# Altium project Camera.PrjPcb
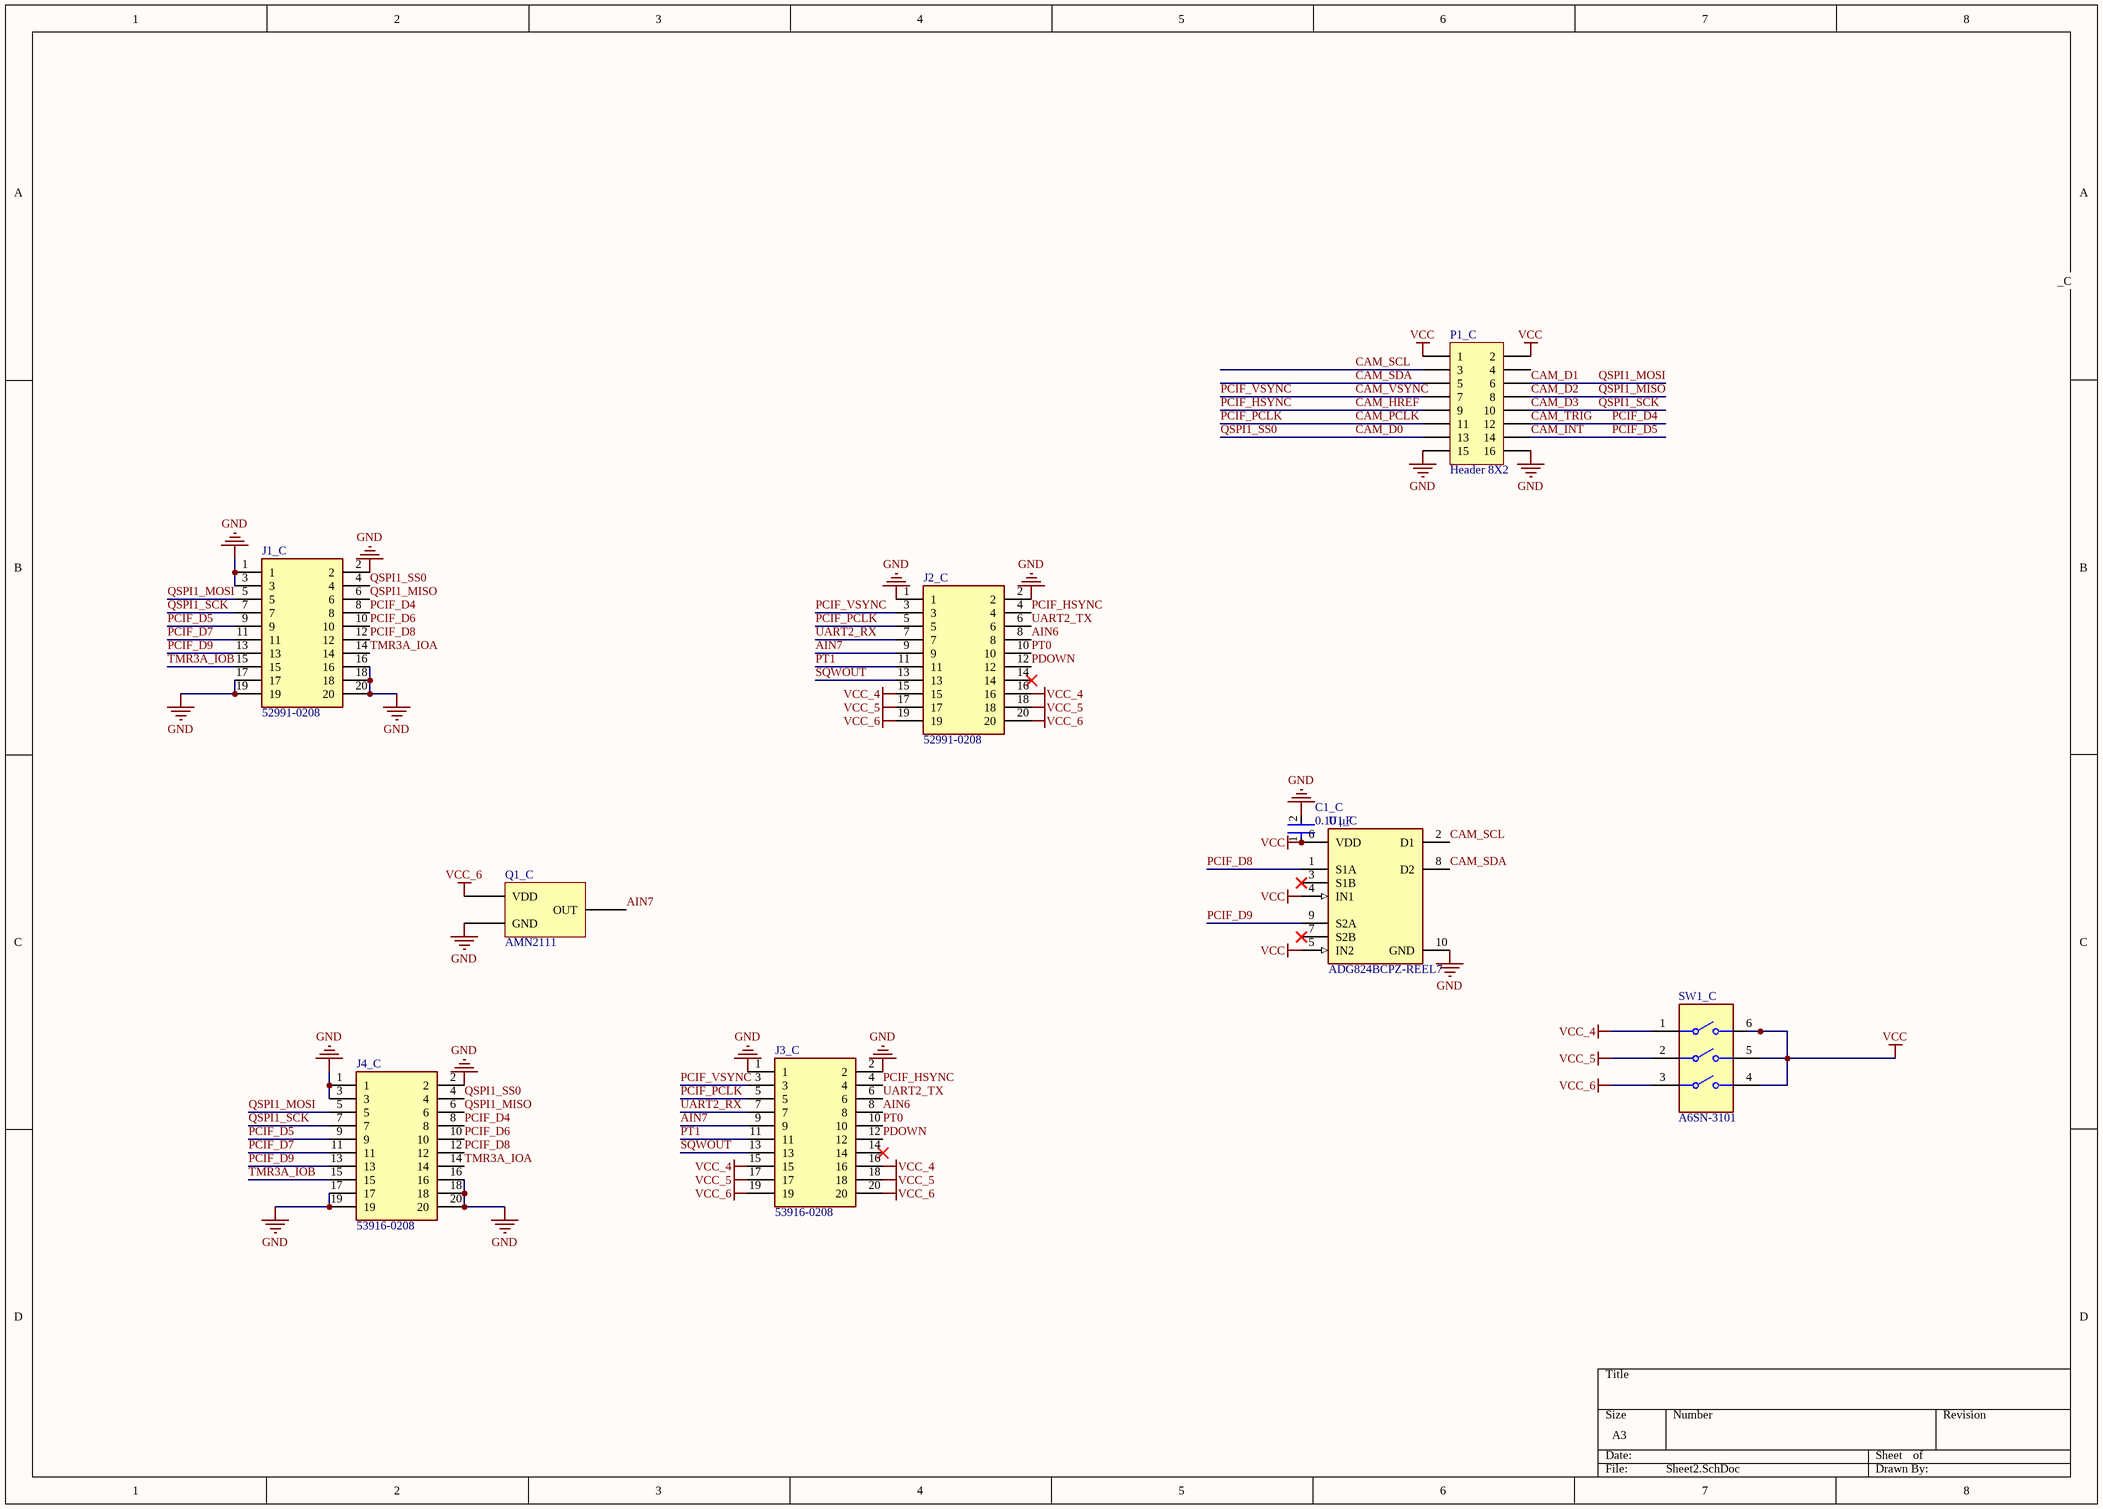
[diagram p0: Sheet2.SchDoc]
1 sheet, 9 parts. Net scope: global (net labels, ports and power ports of the same name join across sheets).
Board file: PCB3.PcbDoc

## Sheet Sheet2.SchDoc
size A3; SheetNumber: 1; SheetTotal: 1

### Parts
C1_C  Capacitance: 0.10 μF  [FP-C0402-BB-MFG]  (hidden comment: C0402C104K8PACTU)
J1_C  52991-0208  [MOLEX_52991-0208]
J2_C  52991-0208  [MOLEX_52991-0208]
J3_C  53916-0208  [MOLEX-  539160208]
J4_C  53916-0208  [MOLEX-  539160208]
P1_C  Header 8X2  [HDR2X8]
Q1_C  AMN2111  [AMN21111]
SW1_C  A6SN-3101  [FP-A6SN-3101-MFG]
U1_C  ADG824BCPZ-REEL7  [FP-CP-10-10-MFG]

### Nets
GND: C1_C.2 J1_C.1 J1_C.2 J1_C.3 J1_C.16 J1_C.17 J1_C.18 J1_C.19 J1_C.20 J2_C.1 J2_C.2 J3_C.1 J3_C.2 J4_C.1 J4_C.2 J4_C.3 J4_C.16 J4_C.17 J4_C.18 J4_C.19 J4_C.20 P1_C.15 P1_C.16 Q1_C.2(GND) U1_C.10(GND)
VCC: C1_C.1 P1_C.1 P1_C.2 SW1_C.4 SW1_C.5 SW1_C.6 U1_C.4(IN1) U1_C.5(IN2) U1_C.6(VDD)
VCC_4: J2_C.15 J2_C.16 J3_C.15 J3_C.16 SW1_C.1
VCC_5: J2_C.17 J2_C.18 J3_C.17 J3_C.18 SW1_C.2
VCC_6: J2_C.19 J2_C.20 J3_C.19 J3_C.20 Q1_C.1(VDD) SW1_C.3
AIN6: J2_C.8 J3_C.8
AIN7: J2_C.9 J3_C.9 Q1_C.3(OUT)
CAM_D0: J1_C.4 J4_C.4 P1_C.13  [also labelled QSPI1_SS0]
CAM_D1: J1_C.5 J4_C.5 P1_C.6  [also labelled QSPI1_MOSI]
CAM_D2: J1_C.6 J4_C.6 P1_C.8  [also labelled QSPI1_MISO]
CAM_D3: J1_C.7 J4_C.7 P1_C.10  [also labelled QSPI1_SCK]
CAM_HREF: J2_C.4 J3_C.4 P1_C.9  [also labelled PCIF_HSYNC]
CAM_INT: J1_C.9 J4_C.9 P1_C.14  [also labelled PCIF_D5]
CAM_PCLK: J2_C.5 J3_C.5 P1_C.11  [also labelled PCIF_PCLK]
CAM_SCL: P1_C.3 U1_C.2(D1)
CAM_SDA: P1_C.5 U1_C.8(D2)
CAM_TRIG: J1_C.8 J4_C.8 P1_C.12  [also labelled PCIF_D4]
CAM_VSYNC: J2_C.3 J3_C.3 P1_C.7  [also labelled PCIF_VSYNC]
PCIF_D6: J1_C.10 J4_C.10
PCIF_D7: J1_C.11 J4_C.11
PCIF_D8: J1_C.12 J4_C.12 U1_C.1(S1A)
PCIF_D9: J1_C.13 J4_C.13 U1_C.9(S2A)
PDOWN: J2_C.12 J3_C.12
PT0: J2_C.10 J3_C.10
PT1: J2_C.11 J3_C.11
SQWOUT: J2_C.13 J3_C.13
TMR3A_IOA: J1_C.14 J4_C.14
TMR3A_IOB: J1_C.15 J4_C.15
UART2_RX: J2_C.7 J3_C.7
UART2_TX: J2_C.6 J3_C.6

Not connected (* = marked no-connect by the designer): J2_C 14*; J3_C 14*; P1_C 4; U1_C 3(S1B)* 7(S2B)*

### Notes on the sheet
- _C

### Library data of the parts
C1_C = CMP-2008-02046-2: CAP CER 0.1UF 10V X5R 0402; Manufacturer: Kemet; Material: Ceramic; Temperature Coefficient: 15%; Tolerance: 0.1; Value: 0.10 μF; Package: C0402-BB; Temperature: -55°C to +125°C; ComponentLink2Description: Datasheet; Temperature Characteristic: X5R; Device Class L1: Passive Components; Height: 0.55mm; Lead Free: Yes; ComponentLink2URL: https://content.kemet.com/datasheets/KEM_C1002_X7R_SMD.pdf; Device Class L2: Capacitors; Temperature Range Low: -55°C; Temperature Range High: +125°C; RoHS: TRUE; Octopart: https://octopart.com/c0402c104k8pactu-kemet-140039; Automotive: No; Mouser Description: Capacitor 100 nF 10 VDC 0402; Category: Cap; Voltage Rating: 10 V; Digikey Description: CAP CER 0.1UF 10V X5R 0402; Ipc Land Pattern Name: CAPC10050X50; Device Class L3: Ceramic Capacitors; Manufacturer Part Number: C0402C104K8PACTU
J1_C J2_C = 52991-0208: 20 Position Connector Receptacle, Center Strip Contacts Surface Mount Gold; MF: Molex; SnapEDA_Link: https://www.snapeda.com/parts/52991-0208/Molex/view-part/230631/?ref=snap; Availability: Unavailable; MP: 52991-0208; Price: None; Package: None; Value: *
P1_C = Header 8X2: Header, 8-Pin, Dual row; LatestRevisionDate: 17-Jul-2002; LatestRevisionNote: Re-released for DXP Platform.; Publisher: Altium Limited
SW1_C = CMP-08827-000007-1: SWITCH SLIDE DIP SPST 25MA 24V; Manufacturer: Omron Electronics Inc-EMC Div; Electromechanical Life: 1000Cycles; Contact Resistance: 200mΩ; Standoff Height: 0.7mm; Description: DIP Switches / SIP Switches 3P Knife-Edge, 2.3mm Slide SMT Flat-Act; Number Of Circuits: 3; Device Class L2: Switches; Device Class L3: DIP Switches; Ambient Temperature Range High: +85°C; RoHS: TRUE; Temperature Range High: +85°C; Ambient Temperature Range Low: -30°C; ComponentLink2URL: https://omronfs.omron.com/en_US/ecb/products/pdf/en-a6sn.pdf; Category: Switch; Temperature Range Low: -30°C; Digikey Description: SWITCH SLIDE DIP SPST 25MA 24V; Package: A6SN-3101; Mouser Description: DIP Switches / SIP Switches 3P Knife-Edge, 2.3mm Slide SMT Flat-Act; Device Class L1: Electromechanical; Current Rating: 25mA; Lead Free: Yes; ComponentLink2Description: Datasheet; Throw Configuration: SPST; Voltage Rating Dc: 24V; Height: 4.55mm; Octopart: https://octopart.com/a6sn-3101-omron-55396000; Automotive: No; Manufacturer Part Number: A6SN-3101; Temperature: -30°C to +85°C
U1_C = CMP-09113-000012-1: IC SWITCH DUAL SPDT 10LFCSP; Manufacturer: Analog Devices; Nominal Supply Current: 0.003uA; Max Supply Voltage: 3.6V; Interface: LVCMOS; On State Resistance: 0.5Ω; -3Db Bandwith: 90MHz; Number Of Circuits: 2; Mux Demux Ratio: 1:2; Standoff Height: 0.02mm; Min Supply Voltage: 1.65V; Temperature: -40°C to +85°C; ComponentLink2URL: https://www.analog.com/media/en/technical-documentation/data-sheets/ADG824.pdf; Device Class L2: Interface ICs; Octopart: https://octopart.com/adg824bcpz-reel7-analog+devices-12410880; Temperature Range High: +85°C; Manufacturer Part Number: ADG824BCPZ-REEL7; Lead Free: Yes; Temperature Range Low: -40°C; ComponentLink2Description: Datasheet; Footprint Url: https://www.analog.com/media/en/symbols-footprints/symbols/ADG824BCPZ-REEL7.bxl; RoHS: TRUE; Device Class L3: Analog Switches; Device Class L1: Integrated Circuits (ICs); Automotive: No; Height: 0.6mm; Package: CP-10-10; Throw Configuration: SPDT; Category: IC; Digikey Description: IC SWITCH DUAL SPDT 10LFCSP